# EAGLE design zdroj (EAGLE 5.10)
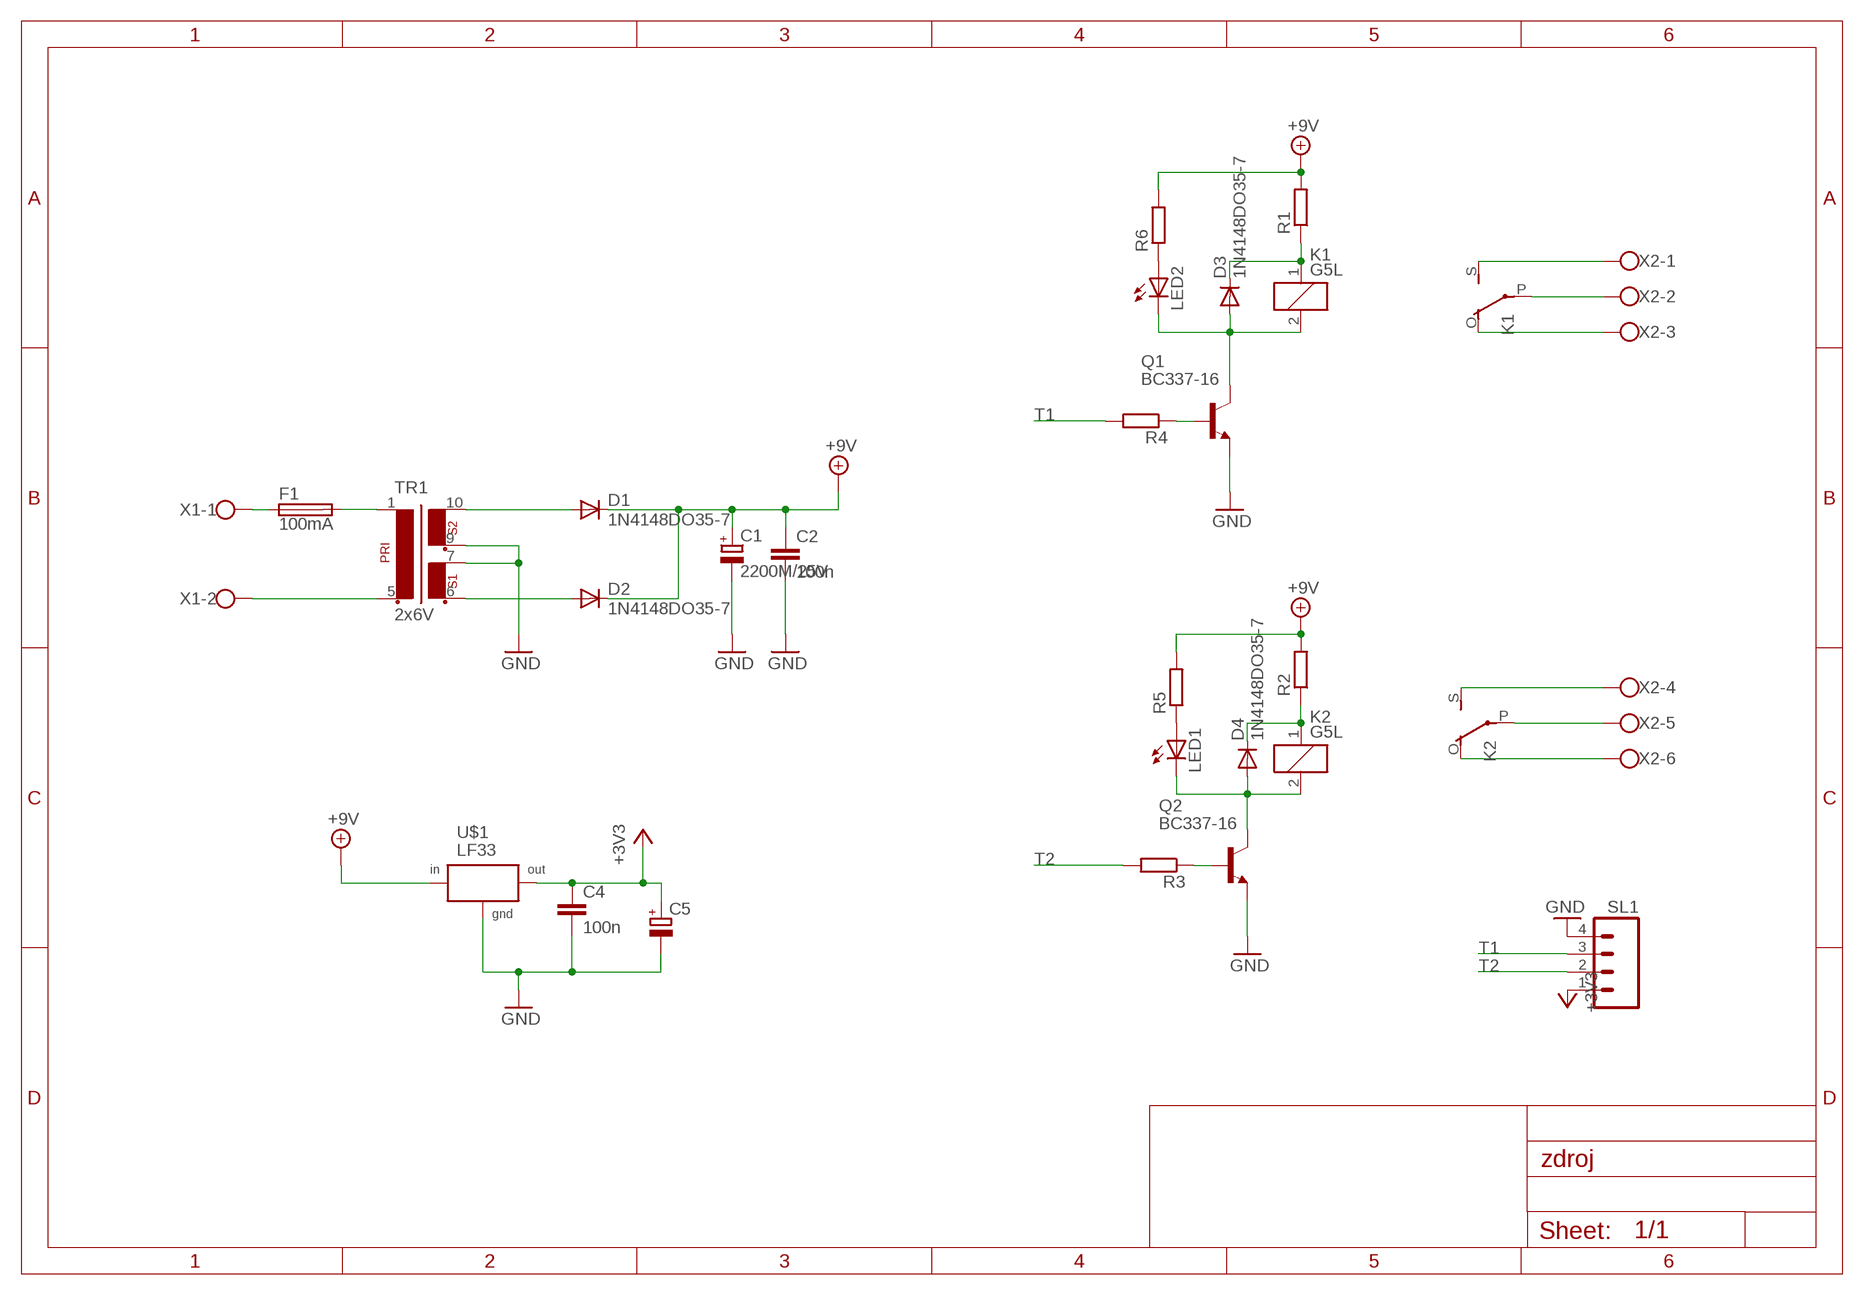
[diagram p0: schematic, sheet 1]

## Parts
C1  2200M/25V  CPOL-EUE7.5-16  [E7,5-16]
C2  100n  C-EUC1206  [C1206]
C4  100n  C-EUC1206  [C1206]
C5  CPOL-EUE2-5  [E2-5]
D1  1N4148DO35-7  [DO35-7]
D2  1N4148DO35-7  [DO35-7]
D3  1N4148DO35-7  [DO35-7]
D4  1N4148DO35-7  [DO35-7]
F1  100mA  SH22,5A  [SH22,5A]
K1  G5L  [G5LE]
K2  G5L  [G5LE]
LED1  LED3MM  [LED3MM]
LED2  LED3MM  [LED3MM]
Q1  BC337-16  [TO92]
Q2  BC337-16  [TO92]
R1  R-EU_M0805  [M0805]
R2  R-EU_M0805  [M0805]
R3  R-EU_M0805  [M0805]
R4  R-EU_M0805  [M0805]
R5  R-EU_M0805  [M0805]
R6  R-EU_M0805  [M0805]
SL1  M04  [04P]
TR1  2x6V  EI30-2  [EI30-2]
U$1  LF33  [DPACK]
X1  W237-102  [W237-102]
X2  W237-136  [W237-136]

## Nets
+3V3: C4.1 C5.+ SL1.1 U$1.3(OUT)
+9V: C1.+ C2.1 D1.C D2.C R1.2 R2.2 R5.2 R6.2 U$1.1(IN)
GND: C1.- C2.2 C4.2 C5.- Q1.1(E) Q2.1(E) SL1.4 TR1.7 TR1.9 U$1.2(GND)
N$1: F1.1 X1.1
N$2: TR1.5 X1.2
N$3: F1.2 TR1.1
N$4: D2.A TR1.6
N$5: D1.A TR1.10
N$6: LED1.A R5.1
N$7: D3.A K1.2 LED2.K(C) Q1.3(C)
N$8: LED2.A R6.1
N$9: K2.P(2:P) X2.5
N$10: K2.O(2:O) X2.6
N$11: K2.S(2:S) X2.4
N$12: K1.O(2:O) X2.3
N$13: K1.P(2:P) X2.2
N$14: K1.S(2:S) X2.1
N$15: D4.C K2.1 R2.1
N$16: D4.A K2.2 LED1.K(C) Q2.3(C)
N$18: D3.C K1.1 R1.1
N$19: Q2.2(B) R3.1
N$20: Q1.2(B) R4.1
T1: R4.2 SL1.3
T2: R3.2 SL1.2

## Library data of the parts
C1 C5 = rcl:CPOL-EU: POLARIZED CAPACITOR, European symbol
C2 C4 = rcl:C-EU: CAPACITOR, European symbol
D1-D4 = diode:1N4148: DIODE high speed (Philips)
F1 = fuse:SH22,5A: FUSE HOLDER grid 22,5mm, isolated cap OGN0031 8201, Schurter (Buerklin)
K1 K2 = relay:G5L: RELAY 1 x switch, 10 A/120 V AC, 8 A/30 V ADC, Omron
LED1 LED2 = led:LED: LED OSRAM: - CHIPLED LG R971, LG N971, LY N971, LG Q971, LY Q971, LO R971, LY R971 LH N974, LH R974 LS Q976, LO Q976, LY Q976 LO Q996 - Hyper CHIPLED LW Q18S LB Q993, LB Q99A, LB R99A - SideLED LS A670, LO A670, LY A670, LG A670, LP A670 LB A673, LV A673, LT A673, LW A673 LH A674 LY A675 LS A676, LA A676, LO A676, LY A676, LW A676 LS A679, LY A679, LG A679 - Hyper Micro SIDELED® LS Y876, LA Y876, LO Y876, LY Y876 LT Y87S - SmartLED LW L88C, LW L88S LB L89C, LB L89S, LG L890 LS L89K, LO L89K, LY L89K LS L896, LA L896, LO L896, LY L896 - TOPLED LS T670, LO T670, LY T670, LG T670, LP T670 LSG T670, LSP T670, LSY T670, LOP T670, LYG T670 LG T671, LOG T671, LSG T671 LB T673, LV T673, LT T673, LW T673 LH T674 LS T676, LA T676, LO T676, LY T676, LB T676, LH T676, LSB T676, LW T676 LB T67C, LV T67C, LT T67C, LS T67K, LO T67K, LY T67K, LW E67C LS E67B, LA E67B, LO E67B, LY E67B, LB E67C, LV E67C, LT E67C LW T67C LS T679, LY T679, LG T679 LS T770, LO T770, LY T770, LG T770, LP T770 LB T773, LV T773, LT T773, LW T773 LH T774 LS E675, LA E675, LY E675, LS T675 LS T776, LA T776, LO T776, LY T776, LB T776 LHGB T686 LT T68C, LB T68C - Hyper Mini TOPLED® LB M676 - Mini TOPLED Santana® LG M470 LS M47K, LO M47K, LY M47K Source: http://www.osram.convergy.de LUXEON: - LUMILED® LXK2-PW12-R00, LXK2-PW12-S00, LXK2-PW14-U00, LXK2-PW14-V00 LXK2-PM12-R00, LXK2-PM12-S00, LXK2-PM14-U00 LXK2-PE12-Q00, LXK2-PE12-R00, LXK2-PE12-S00, LXK2-PE14-T00, LXK2-PE14-U00 LXK2-PB12-K00, LXK2-PB12-L00, LXK2-PB12-M00, LXK2-PB14-N00, LXK2-PB14-P00, LXK2-PB14-Q00 LXK2-PR12-L00, LXK2-PR12-M00, LXK2-PR14-Q00, LXK2-PR14-R00 LXK2-PD12-Q00, LXK2-PD12-R00, LXK2-PD12-S00 LXK2-PH12-R00, LXK2-PH12-S00 LXK2-PL12-P00, LXK2-PL12-Q00, LXK2-PL12-R00 Source: www.luxeon.com KINGBRIGHT: KA-3528ASYC Source: www.kingbright.com
Q1 Q2 = transistor-npn:BC337*: NPN Transistor
R1-R6 = rcl:R-EU_: RESISTOR, European symbol
SL1 = con-amp-quick:M04: AMP QUICK CONNECTOR
TR1 = trafo:EI30-2: TRANSFORMER 1 primary winding, 2 secondary windings ERA
U$1 = custom111027a:LF33: VERY LOW DROP VOLTAGE REGULATORS WITH INHIBIT 3,3V > VERY LOW DROPOUT VOLTAGE (0.45V) > VERY LOW QUIESCENT CURRENT (TYP. > 50 ?A IN OFF MODE, 500 ?A IN ON MODE) > OUTPUT CURRENT UP TO 500 mA > INTERNAL CURRENT AND THERMAL LIMIT > ONLY 2.2 ?F FOR STABILITY > AVAILABLE IN ± 1% (AB) OR ± 2% (C) SELECTION AT 25 °C > SUPPLY VOLTAGE REJECTION: 80db (TYP.) > TEMPERATURE RANGE: -40 TO 125 °C
X1 = con-wago-500:W237-102: WAGO SCREW CLAMP
X2 = con-wago-500:W237-136: WAGO SCREW CLAMP

## Board
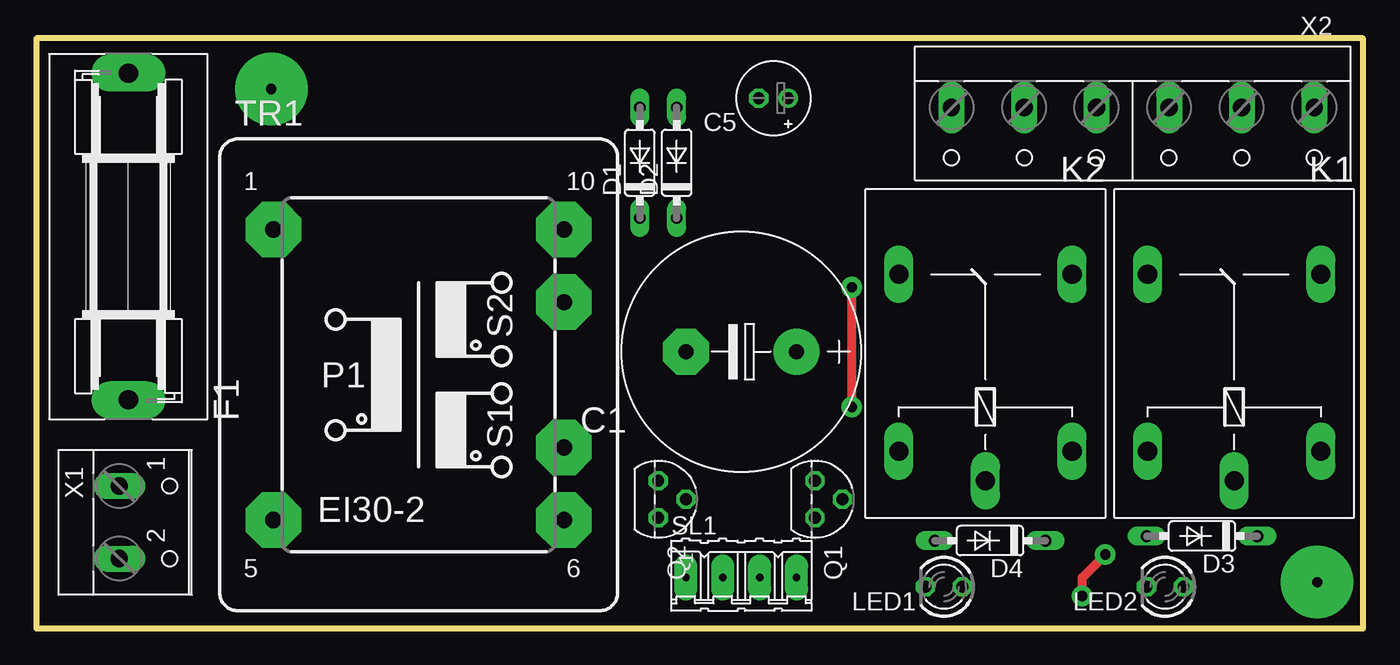
[diagram p1: board, top side]
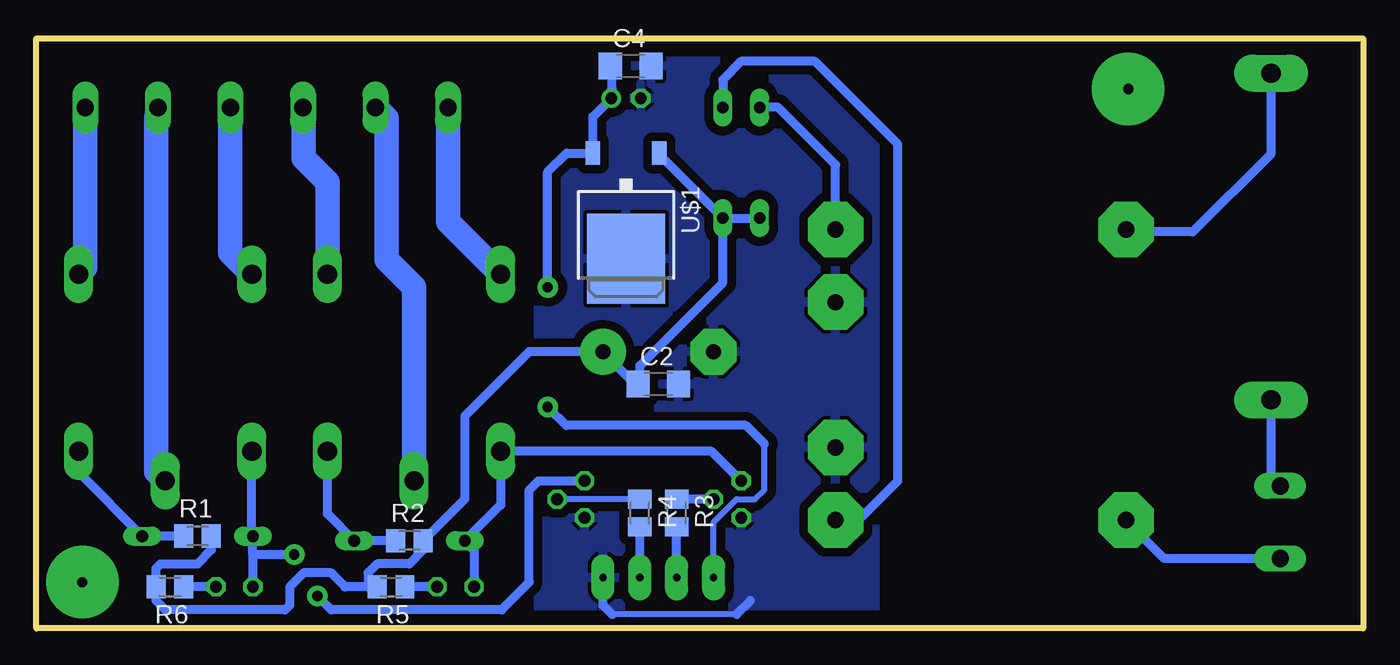
[diagram p2: board, bottom side, seen from below]

Size 91.44 x 40.64 mm. Coordinates in mm from the lower left corner, seen from the top.
Outline: 0,0 91.44,0 91.44,40.64 0,40.64 0,0
Copper layers (1*16): Top 0.035mm / dielectric 1.5mm / Bottom 0.035mm
Design rules "default": minimum track width 10mil, minimum drill 24mil, track to track 8mil, track to pad 8mil, pad to pad 8mil, via to via 8mil, smd to smd 8mil, copper to edge 40mil, drill to drill 8mil, minimum pad ring 10mil, minimum via ring 8mil, stop-mask expansion 4mil, vias tented up to drill 0mil, thermal gap 10mil

### Footprints (pad centres in the part's own frame; a part is rotated, then mirrored left to right if it is on the bottom)
E7,5-16 = drill 1.016 pad 3.15 round: + -3.81,0 | drill 1.016 pad 3.15 octagon: - 3.81,0
C1206 = smd 1.6 x 1.8: 1 -1.4,0; 2 1.4,0
E2-5 = drill 0.813 pad 1.27 round: + -1.016,0 | drill 0.813 pad 1.27 octagon: - 1.016,0
DO35-7 = drill 0.813 long: A 3.81,0; C -3.81,0
SH22,5A = drill 1.321 pad 2.54 long: 1 -11.252,0; 2 11.252,0
G5LE = drill 1.321 long: 1 -7.493,-5.969; 2 -7.493,5.969; O 4.699,5.969; P -9.525,0; S 4.699,-5.969
LED3MM = drill 0.813 octagon: A -1.27,0; K 1.27,0
TO92 = drill 0.813 octagon: 1 1.27,0; 2 0,1.905; 3 -1.27,0
M0805 = smd 1.3 x 1.6: 1 -0.95,0; 2 0.95,0
04P = drill 0.5 pad 1.6 long: 1 -3.81,0; 2 -1.27,0; 3 1.27,0; 4 3.81,0
EI30-2 = drill 1.118 pad 3.81 octagon: 1 -10.008,10.008; 5 -10.008,-10.008; 6 10.008,-10.008; 7 10.008,-5.004; 9 10.008,5.004; 10 10.008,10.008
DPACK = smd 1 x 1.6: 1 -2.28,-4.8; 3 2.28,-4.8 | smd 5.4 x 6.2: 2 0,2.5
W237-102 = drill 1.194 long: 1 -2.5,-1.27; 2 2.5,-1.27
W237-136 = drill 1.194 long: 1 -12.5,-1.27; 2 -7.5,-1.27; 3 -2.5,-1.27; 4 2.5,-1.27; 5 7.5,-1.27; 6 12.5,-1.27

### Placement (x,y rotation side)
C1  48.58,19.05 180 top
C2  48.58,16.83 0 bottom
C4  50.48,38.73 0 bottom
C5  50.8,36.51 180 top
D1  41.59,32.07 90 top
D2  44.13,32.07 90 top
D3  80.33,6.35 180 top
D4  65.72,6.03 180 top
F1  6.35,26.99 90 top
K1  82.55,19.68 90 top
K2  65.41,19.68 90 top
LED1  62.55,2.86 180 top
LED2  77.79,2.86 180 top
Q1  53.66,8.89 270 top
Q2  42.86,8.89 270 top
R1  80.33,6.35 0 bottom
R2  65.72,6.03 0 bottom
R3  47.31,7.94 270 bottom
R4  49.85,7.94 270 bottom
R5  66.99,2.86 180 bottom
R6  82.23,2.86 180 bottom
SL1  48.58,3.49 0 top
TR1  26.35,17.46 0 top
U$1  50.8,27.94 180 bottom
X1  6.99,7.3 270 top
X2  75.56,34.61 180 top

### Tracks (layer width: path | path; a pad name or v marks a point on that pad's centre or on a via)
+3V3  (via drill 0.7 pad 1.42)
  Top 0.61: v56.2,15.24 v56.2,23.5
  Bottom 0.406: SL1.1 44.77,7.3 43.18,8.89 41.91,8.89 41.27,9.53 41.27,12.7
  Bottom 0.61: C4.1 51.75,38.6 51.75,37.15 51.82,37.08 C5.+ 53.08,35.25 U$1.3 54.89,32.74 56.2,31.43 v56.2,23.5 | 41.27,12.7 42.55,13.97 54.93,13.97 v56.2,15.24
+9V
  Bottom 0.61: R1.2 79.38,5.39 80.33,4.45 82.87,4.45 83.19,4.13 R6.2 83.19,1.91 82.55,1.27 74.3,1.27 73.98,1.59 73.98,2.86 73.03,3.81 71.12,3.81 70.17,2.86 R5.2 68.58,2.86 68.58,3.81 67.94,4.45 65.72,4.45 64.77,5.39 R2.2 61.91,8.89 61.91,14.61 57.47,19.05 C1.+ 50.16,16.83 C2.1 49.85,16.96 49.85,18.1 44.13,23.81 D2.C | D2.C D1.C | D2.C 48.52,32.65 U$1.1
GND
  Bottom 0.406: 43.18,0.95 51.75,0.95
  Bottom 0.61: SL1.4 52.39,1.59 51.75,0.95 | 42.23,1.91 43.18,0.95
  pour Bottom (isolate 0.61): 33.66,39.37 33.66,1.27 56.83,1.27 56.83,2.54 56.83,39.37
N$1
  Bottom 0.61: X1.1 6.35,10.44 F1.1
N$2
  Bottom 0.61: TR1.5 13.69,4.8 X1.2
N$3
  Bottom 0.61: F1.2 6.35,32.7 11.75,27.3 16.18,27.3 TR1.1
N$4
  Bottom 0.61: TR1.6 34.77,7.46 32.07,10.16 32.07,33.34 37.78,39.05 42.86,39.05 44.13,37.78 D2.A
N$5
  Bottom 0.61: TR1.10 36.36,31.91 40.32,35.88 D1.A
N$6
  Bottom 0.61: LED1.A R5.1
N$7  (via drill 0.7 pad 1.42)
  Top 0.61: v72.07,2.22 72.07,3.49 v73.66,5.08
  Bottom 0.61: K1.2 76.58,6.41 D3.A 76.52,5.08 | Q1.3 56.83,10.16 57.47,9.53 57.47,3.17 59.37,1.27 71.12,1.27 v72.07,2.22 | 76.52,5.08 LED2.K | v73.66,5.08 76.52,5.08
N$8
  Bottom 0.61: LED2.A R6.1
N$9
  Bottom 1.676: K2.P 65.41,23.5 67.31,25.4 67.31,35.12 X2.5
N$10
  Bottom 1.676: K2.O 63.06,28.01 X2.6
N$11
  Bottom 1.676: K2.S 71.37,30.73 73.03,32.38 73.03,35.84 X2.4
N$12
  Bottom 1.676: K1.O 78.06,25.87 X2.3
N$13
  Bottom 1.676: K1.P 83.19,10.79 83.19,35.24 83.06,35.36 X2.2
N$14
  Bottom 1.676: K1.S 88.06,24.84 X2.1
N$15
  Bottom 0.61: K2.1 71.37,7.87 D4.C R2.1
N$16
  Bottom 0.61: LED1.K 61.28,5.4 D4.A 59.44,8.51 K2.2 44.9,12.19 Q2.3
N$17  (via drill 0.7 pad 5)
  other vias: 16.19,37.15
N$18
  Bottom 0.61: K1.1 88.52,10.73 D3.C R1.1
N$19
  Bottom 0.61: Q2.2 R3.1
N$20
  Bottom 0.406: R4.1 Q1.2
  Bottom 0.61: R4.1
N$21  (via drill 0.7 pad 5)
  other vias: 88.27,3.17
T1
  Bottom 0.61: SL1.3 R4.2
T2
  Bottom 0.61: SL1.2 R3.2